# Altium schematic sheet 5G智慧网关工装2.SchDoc
size A3
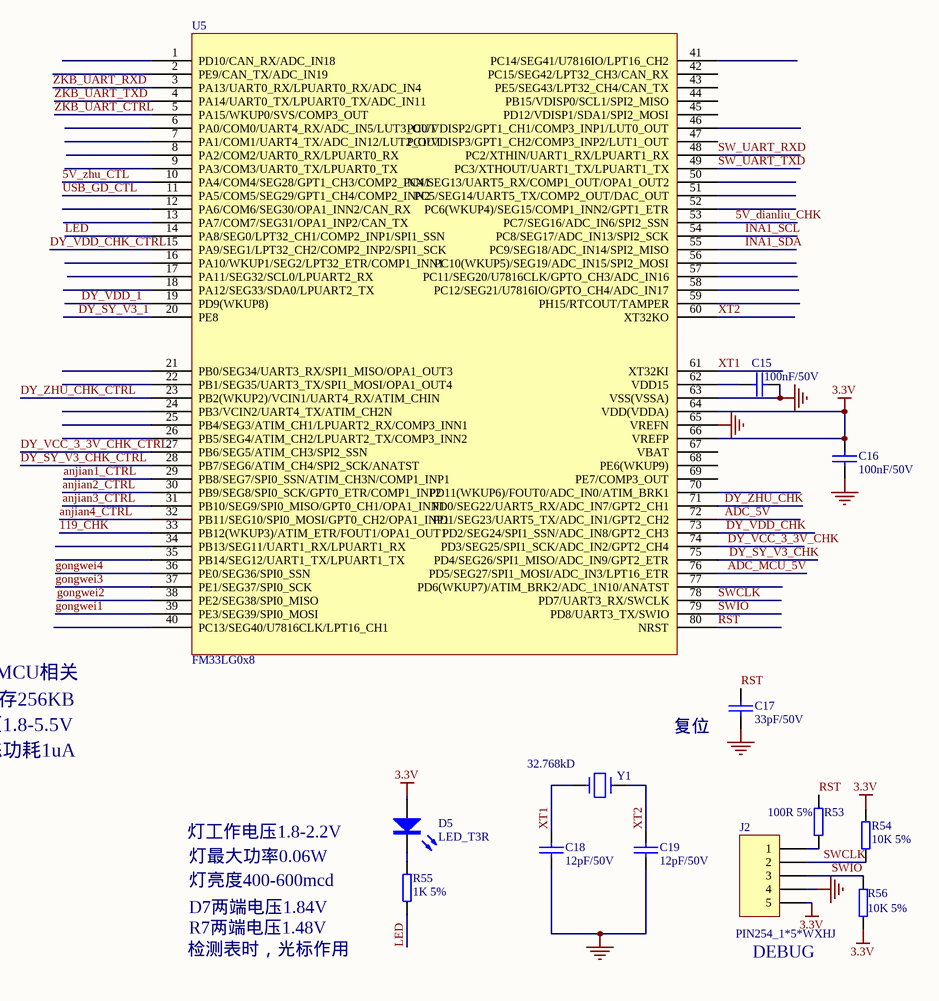
[diagram p0: 5G智慧网关工装2.SchDoc]

## Parts
C15  100nF/50V  [CAP0603]
C16  100nF/50V  [CAP0603]
C17  33pF/50V  [CAP0603]
C18  12pF/50V  [CAP0603]
C19  12pF/50V  [CAP0603]
D5  LED_T3R  [LED2_300]
J2  PIN254_1*5*WXHJ  [PIN254_1*5*1100S]
R53  100R 5%  [RES0603]
R54  10K 5%  [RES0603]
R55  1K 5%  [RES0603]
R56  10K 5%  [RES0603]
U5  FM33LG0x8  [LQFP80]
Y1  32.768kD  [SMD-3215_2P]

## Nets
3.3V: C16.2 D5.1 J2.5 R54.1 R56.1 U5.64(VDD(VDDA)) U5.66(VREFP)
GND: C15.2 C16.1 C17.2 C18.2 C19.1 J2.4 U5.63(VSS(VSSA)) U5.65(VREFN)
5V_dianliu_CHK: U5.53(PC7/SEG16/ADC_IN6/SPI2_SSN)
5V_zhu_CTL: U5.10(PA4/COM4/SEG28/GPT1_CH3/COMP2_INN1)
119_CHK: U5.33(PB12(WKUP3)/ATIM_ETR/FOUT1/OPA1_OUT1)
ADC_5V: U5.72(PD1/SEG23/UART5_TX/ADC_IN1/GPT2_CH2)
ADC_MCU_5V: U5.76(PD5/SEG27/SPI1_MOSI/ADC_IN3/LPT16_ETR)
anjian1_CTRL: U5.29(PB8/SEG7/SPI0_SSN/ATIM_CH3N/COMP1_INP1)
anjian2_CTRL: U5.30(PB9/SEG8/SPI0_SCK/GPT0_ETR/COMP1_INP2)
anjian3_CTRL: U5.31(PB10/SEG9/SPI0_MISO/GPT0_CH1/OPA1_INN1)
anjian4_CTRL: U5.32(PB11/SEG10/SPI0_MOSI/GPT0_CH2/OPA1_INP1)
DY_SY_V3_1: U5.20(PE8)
DY_SY_V3_CHK: U5.75(PD4/SEG26/SPI1_MISO/ADC_IN9/GPT2_ETR)
DY_SY_V3_CHK_CTRL: U5.28(PB7/SEG6/ATIM_CH4/SPI2_SCK/ANATST)
DY_VCC_3_3V_CHK: U5.74(PD3/SEG25/SPI1_SCK/ADC_IN2/GPT2_CH4)
DY_VCC_3_3V_CHK_CTRL: U5.27(PB6/SEG5/ATIM_CH3/SPI2_SSN)
DY_VDD_1: U5.19(PD9(WKUP8))
DY_VDD_CHK: U5.73(PD2/SEG24/SPI1_SSN/ADC_IN8/GPT2_CH3)
DY_VDD_CHK_CTRL: U5.15(PA9/SEG1/LPT32_CH2/COMP2_INP2/SPI1_SCK)
DY_ZHU_CHK: U5.71(PD0/SEG22/UART5_RX/ADC_IN7/GPT2_CH1)
DY_ZHU_CHK_CTRL: U5.23(PB2(WKUP2)/VCIN1/UART4_RX/ATIM_CHIN)
gongwei1: U5.39(PE3/SEG39/SPI0_MOSI)
gongwei2: U5.38(PE2/SEG38/SPI0_MISO)
gongwei3: U5.37(PE1/SEG37/SPI0_SCK)
gongwei4: U5.36(PE0/SEG36/SPI0_SSN)
INA1_SCL: U5.54(PC8/SEG17/ADC_IN13/SPI2_SCK)
INA1_SDA: U5.55(PC9/SEG18/ADC_IN14/SPI2_MISO)
LED: R55.1 U5.14(PA8/SEG0/LPT32_CH1/COMP2_INP1/SPI1_SSN)
RST: C17.1 R53.1 U5.80(NRST)
SW_UART_RXD: U5.48(PC2/XTHIN/UART1_RX/LPUART1_RX)
SW_UART_TXD: U5.49(PC3/XTHOUT/UART1_TX/LPUART1_TX)
SWCLK: J2.2 R54.2 U5.78(PD7/UART3_RX/SWCLK)
SWIO: J2.3 R56.2 U5.79(PD8/UART3_TX/SWIO)
USB_GD_CTL: U5.11(PA5/COM5/SEG29/GPT1_CH4/COMP2_INN2)
XT1: C18.1 U5.61(XT32KI) Y1.1
XT2: C19.2 U5.60(XT32KO) Y1.2
ZKB_UART_CTRL: U5.5(PA15/WKUP0/SVS/COMP3_OUT)
ZKB_UART_RXD: U5.3(PA13/UART0_RX/LPUART0_RX/ADC_IN4)
ZKB_UART_TXD: U5.4(PA14/UART0_TX/LPUART0_TX/ADC_IN11)
NetC15_1: C15.1 U5.62(VDD15)
NetD5_2: D5.2 R55.2
NetJ2_1: J2.1 R53.2

Not connected (* = marked no-connect by the designer): U5 1(PD10/CAN_RX/ADC_IN18) 2(PE9/CAN_TX/ADC_IN19) 6(PA0/COM0/UART4_RX/ADC_IN5/LUT3_OUT) 7(PA1/COM1/UART4_TX/ADC_IN12/LUT2_OUT) 8(PA2/COM2/UART0_RX/LPUART0_RX) 9(PA3/COM3/UART0_TX/LPUART0_TX) 12(PA6/COM6/SEG30/OPA1_INN2/CAN_RX) 13(PA7/COM7/SEG31/OPA1_INP2/CAN_TX) 16(PA10/WKUP1/SEG2/LPT32_ETR/COMP1_INN1) 17(PA11/SEG32/SCL0/LPUART2_RX) 18(PA12/SEG33/SDA0/LPUART2_TX) 21(PB0/SEG34/UART3_RX/SPI1_MISO/OPA1_OUT3) 22(PB1/SEG35/UART3_TX/SPI1_MOSI/OPA1_OUT4) 24(PB3/VCIN2/UART4_TX/ATIM_CH2N) 25(PB4/SEG3/ATIM_CH1/LPUART2_RX/COMP3_INN1) 26(PB5/SEG4/ATIM_CH2/LPUART2_TX/COMP3_INN2) 34(PB13/SEG11/UART1_RX/LPUART1_RX) 35(PB14/SEG12/UART1_TX/LPUART1_TX) 40(PC13/SEG40/U7816CLK/LPT16_CH1) 41(PC14/SEG41/U7816IO/LPT16_CH2) 42(PC15/SEG42/LPT32_CH3/CAN_RX) 43(PE5/SEG43/LPT32_CH4/CAN_TX) 44(PB15/VDISP0/SCL1/SPI2_MISO) 45(PD12/VDISP1/SDA1/SPI2_MOSI) 46(PC0/VDISP2/GPT1_CH1/COMP3_INP1/LUT0_OUT) 47(PC1/VDISP3/GPT1_CH2/COMP3_INP2/LUT1_OUT) 50(PC4/SEG13/UART5_RX/COMP1_OUT/OPA1_OUT2) 51(PC5/SEG14/UART5_TX/COMP2_OUT/DAC_OUT) 52(PC6(WKUP4)/SEG15/COMP1_INN2/GPT1_ETR) 56(PC10(WKUP5)/SEG19/ADC_IN15/SPI2_MOSI) 57(PC11/SEG20/U7816CLK/GPTO_CH3/ADC_IN16) 58(PC12/SEG21/U7816IO/GPTO_CH4/ADC_IN17) 59(PH15/RTCOUT/TAMPER) 67(VBAT) 68(PE6(WKUP9)) 69(PE7/COMP3_OUT) 70(PD11(WKUP6)/FOUT0/ADC_IN0/ATIM_BRK1) 77(PD6(WKUP7)/ATIM_BRK2/ADC_1N10/ANATST)

## Notes on the sheet
- MCU相关
- 工作电压1.8-5.5V
- 单片机内存256KB
- 静态功耗1uA
- 复位
- 灯工作电压1.8-2.2V
- 灯最大功率0.06W
- D7两端电压1.84V
- 灯亮度400-600mcd
- 检测表时，光标作用
- R7两端电压1.48V
- (near J2) DEBUG

## Library data of the parts
C15 C16 = 101020103-0021: 104pF,50 V,±10%,0603,国巨,CC0603KRX7R9BB104; Part Name: 0603贴片电容; ID: 3; SMD/DIP: SMD; Part Number: 101020103-0021
C17 = 101020103-0027: 33pF,50 V,±10%,0603,国巨,CC0603KRNPO9BN33; Part Name: 0603贴片电容; ID: 17; SMD/DIP: SMD; Part Number: 101020103-0027
C18 C19 = 101020103-0005: 12P,50 V,±5%,0603,国巨,CC0603JRNPO9BN12; Part Name: 0603贴片电容; ID: 11; SMD/DIP: SMD; Part Number: 101020103-0005
D5 = 101040102-0001: 圆形插件,3mm 圆形,插件,红光,湖北匡通电子有限公司,3BB4HC; Part Name: 发光二极管; ID: 6; SMD/DIP: DIP; Part Number: 101040102-0001
J2 = AD_WXHJ_PinHeader_02: 1*5 ，Φ1.0 ，2.54mm，直脚,无需焊接器件; Part Name: 排针; ID: 17; SMD/DIP: DIP; Part Number: AD_WXHJ_PinHeader_02
R53 = 101010103-0022: 100R,±5%,1/10W,0603,国巨,RC0603JR-07100RL; Part Name: 0603贴片电阻; ID: 5; SMD/DIP: SMD; Part Number: 101010103-0022
R54 R56 = 101010103-0003: 国巨,±5%,0603,,155 ℃,-55 ℃,RC0603JR-0710KL,无铅,200 ppm/℃,1/10W,,10K; Part Name: 0603贴片电阻; ID: 7; SMD/DIP: SMD; Part Number: 101010103-0003
R55 = 101010103-0008: 1K,±5%,1/10W,0603,国巨,RC0603JR-071KL; Part Name: 0603贴片电阻; ID: 9; SMD/DIP: SMD; Part Number: 101010103-0008
Y1 = 1010601-0009: Part Number: 1010601-0020; Part Name: 贴片晶振; ID: 20; SMD/DIP: SMD